# EAGLE design stabilizator (EAGLE 9.6.2)
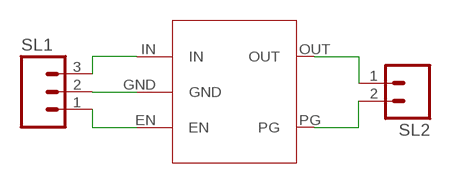
[diagram p0: schematic, sheet 1]

## Parts
SL1  MA03  [03P]
SL2  MA02  [02PA]
U$1  LDLN030  [LDLN030]

## Nets
N$1: SL1.3 U$1.IN
N$2: SL1.2 U$1.GND
N$3: SL1.1 U$1.EN
N$4: SL2.1 U$1.OUT
N$5: SL2.2 U$1.PG

## Library data of the parts
SL1 = con-amp-quick:MA03: AMP QUICK CONNECTOR; OC_FARNELL: unknown; OC_NEWARK: unknown
SL2 = con-amp-quick:MA02: AMP QUICK CONNECTOR; OC_FARNELL: unknown; OC_NEWARK: unknown
U$1 = WT8266:LDLN030

## Board
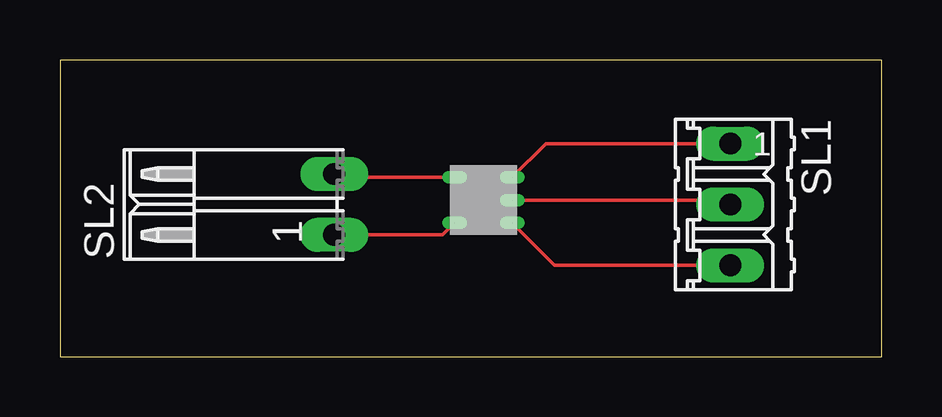
[diagram p1: board, top side]

Size 34.27 x 12.37 mm. Coordinates in mm from the lower left corner, seen from the top.
Outline: 0,0 34.27,0 34.27,12.37 0,12.37 0,0
Copper layers (1*16): Top 0.035mm / dielectric 1.5mm / Bottom 0.035mm
Design rules "default": minimum track width 6mil, minimum drill 0.35mm, track to track 6mil, track to pad 6mil, pad to pad 6mil, via to via 6mil, smd to smd 6mil, copper to edge 40mil, drill to drill 6mil, minimum pad ring 10mil, minimum via ring 8mil, stop-mask expansion 4mil, vias tented up to drill 0mil, thermal gap 10mil

### Footprints (pad centres in the part's own frame; a part is rotated, then mirrored left to right if it is on the bottom)
03P = drill 0.914 long: 1 -2.54,0; 2 0,0; 3 2.54,0
02PA = drill 0.914 long: 1 -1.27,0; 2 1.27,0
LDLN030 = drill 0.01 pad 0.406 long: EN 2.4,0.2; GND 1.45,0.2; IN 0.5,0.2; OUT 0.5,2.6; PG 2.4,2.6

### Placement (x,y rotation side)
SL1  27.94,6.35 270 top
SL2  11.43,6.35 90 top
U$1  19.05,5.08 90 top

### Tracks (layer width: path | path; a pad name or v marks a point on that pad's centre or on a via)
N$1
  Top 0.152: U$1.IN 20.62,3.81 SL1.3
N$2
  Top 0.152: U$1.GND 27.76,6.53 SL1.2
N$3
  Top 0.152: U$1.EN 20.26,8.89 SL1.1
N$4
  Top 0.152: U$1.OUT 15.95,5.08 SL2.1
N$5
  Top 0.152: U$1.PG 11.57,7.48 SL2.2